# Altium schematic sheet POWER.SchDoc
size 594 x 420 mm; SheetNumber: 4; SheetTotal: 4
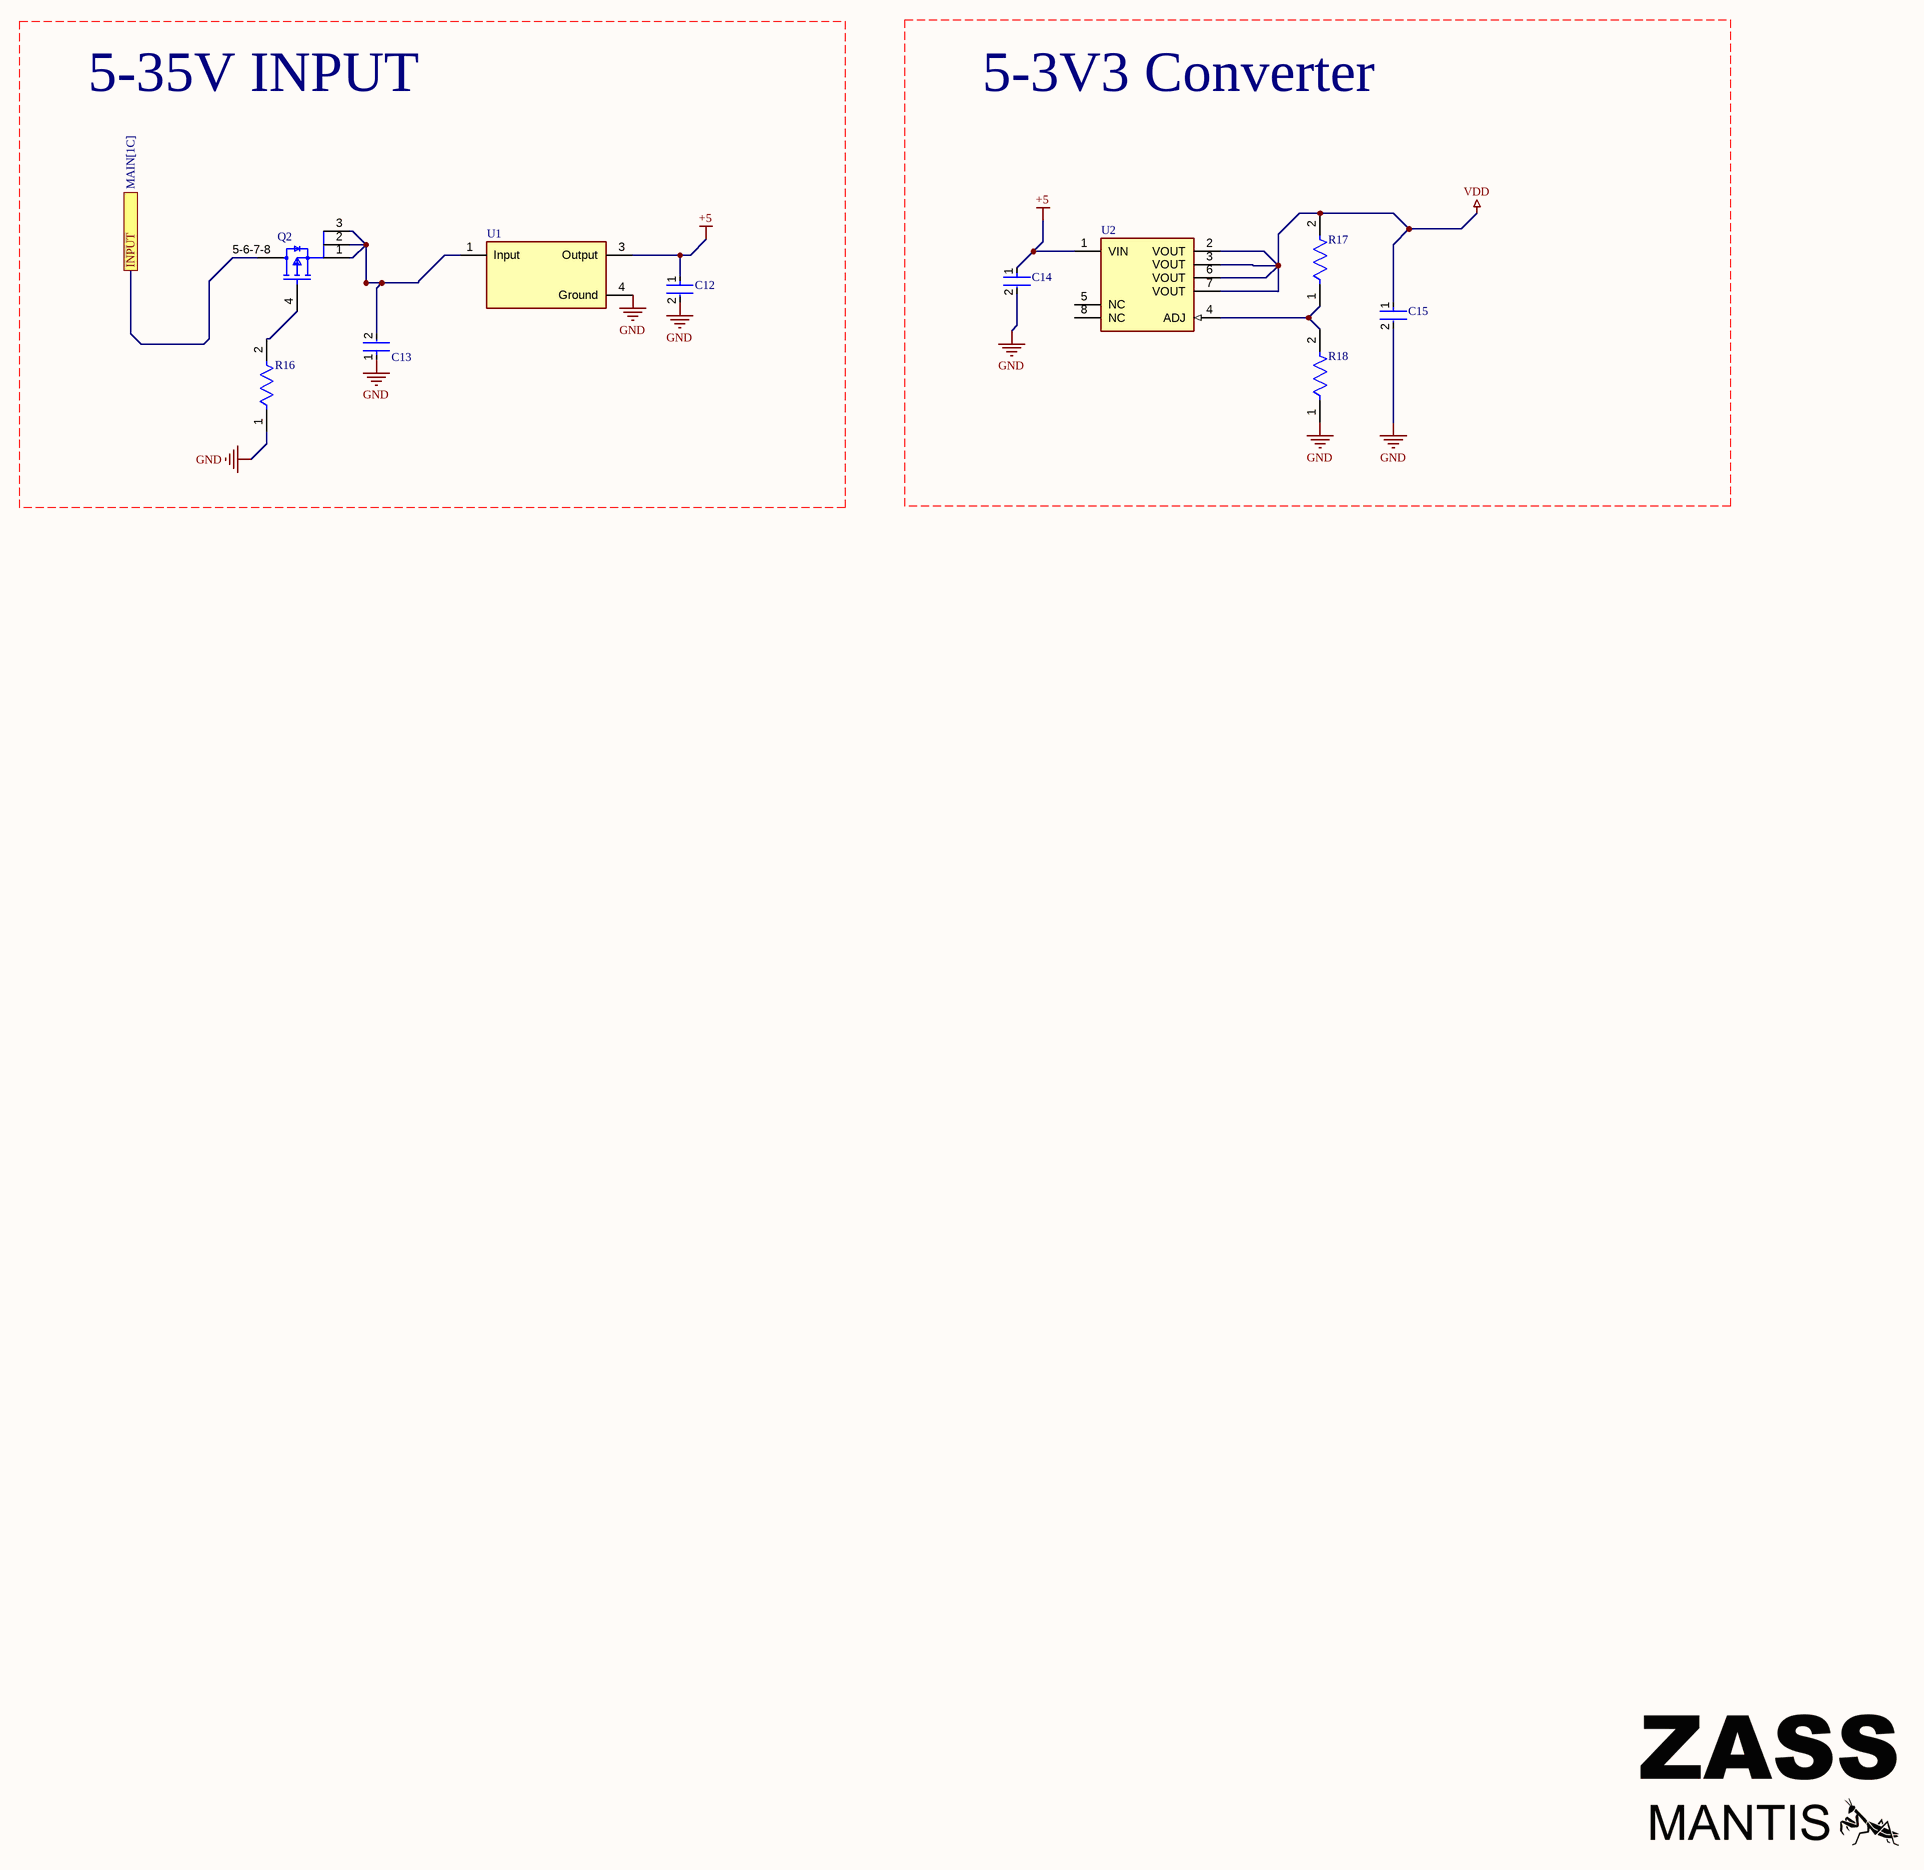
[diagram p0: POWER.SchDoc]

## Parts
C12  CC0805KRX7R5BB104  [FP-CC0805-EA-MFG]  (value not drawn)
C13  C0805C104K5RACTU  [FP-C0805C-DN-MFG]  (value not drawn)
C14  CC0805KRX7R5BB104  [FP-CC0805-EA-MFG]  (value not drawn)
C15  CC0805KRX7R5BB104  [FP-CC0805-EA-MFG]  (value not drawn)
Q2  SI7113ADN-T1-GE3  [FP-S16-2667-SINGLE-MFG]  (value not drawn)
R16  CRGCQ0603F1K2  [FP-CRGCQ0603-IPC_C]  (value not drawn)
R17  CRGCQ0603F1K2  [FP-CRGCQ0603-IPC_C]  (value not drawn)
R18  RC3216J202CS  [FP-RC3216-IPC_A]  (value not drawn)
U1  MC7805CDTRKG  [FP-369C-MFG]  (value not drawn)
U2  LM317LD13TR  [FP-SO-8-0016023-MFG]  (value not drawn)

## Ports
INPUT (see MAIN[1C])

## Nets
+5: C12.1 C14.1 U1.3(Output) U2.1(VIN)
GND: C12.2 C13.1 C14.2 C15.2 R16.1 R18.1 U1.4(Ground)
VDD: C15.1 R17.2 U2.2(VOUT) U2.3(VOUT) U2.6(VOUT) U2.7(VOUT)
INPUT: Q2.5-6-7-8(D) ; port INPUT
NetC13_2: C13.2 Q2.1(S) Q2.2(S) Q2.3(S) U1.1(Input)
NetQ2_4: Q2.4(G) R16.2
NetR17_1: R17.1 R18.2 U2.4(ADJ)

Not connected (* = marked no-connect by the designer): U2 5(NC) 8(NC)

## Notes on the sheet
- 5-35V INPUT
- 5-3V3 Converter
- DWG NO:
- REV:
- THIS DOCUMENT AND THE DATA DISCLOSED HEREIN OR
- HEREWITH IS THE PROPERTY OF ALTIUM LIMITED AND MAY
- BE FREELY DISTRIBUTED IN WHOLE. NO RIGHTS ARE
- RESERVED OR EXPRESS OR IMPLIED WARANTEE GIVEN.
- REVISION
- DESCRIPTION
- DATE
- APPROVED
- PROJECT
- PROJECT REVISION:
- TITLE
- A2
- SIZE
- FILE NAME
- SHEET
- OF

## Library data of the parts
C12 C14 C15 = CMP-03422-000810-2: CAP CER X7R 0805; RoHS Compliant: Yes
C13 = CMP-2007-00279-2: CAP CER 0.1UF 50V X7R 0805; Manufacturer: KEMET; Value: 0.10 μF; Tolerance: 0.1; Temperature Coefficient: 30ppm/°C; Material: Ceramic; Manufacturer Part Number: C0805C104K5RACTU; Device Class L2: Capacitors; Temperature Range Low: -55°C; Voltage Rating: 50 V; Digikey Description: CAP CER 0.1UF 50V X7R 0805; Category: Cap; ComponentLink2Description: Datasheet; Octopart: https://octopart.com/c0805c104k5ractu-kemet-143926; RoHS: TRUE; ComponentLink2URL: https://content.kemet.com/datasheets/KEM_C1003_C0G_SMD.pdf; Temperature Characteristic: X7R; Temperature: -55°C to +125°C; Height: 0.88mm; Temperature Range High: +125°C; Device Class L1: Passive Components; Automotive: No; Lead Free: Yes; Ipc Land Pattern Name: CAPC200125X78; Device Class L3: Ceramic Capacitors; Mouser Description: Cap Ceramic 0.1uF 50V X7R 10% SMD 2.0 x 1.2 mm 125 C Paper T/R; Capacitance: 0.10 μF; Package: C0805C-DN
Q2 = CMP-02550-000064-1: MOSFET P-CH 100V 10.8A 1212-8; Manufacturer: Vishay; Pulse Drain Current: -20A; Reverse Recovery Charge: 80nC; Standoff Height: 0mm; Max Junction Temp: +150°C; Max Forward Diode Voltage: -1.2V; Depletion Mode: False; Turn Off Delay Time: 20ns; Drain To Source Resistance: 0.11Ω; Turn On Delay Time: 10ns; Rthja Max: 36°C/W; Gate Charge At Vgs: 10.9nC @ -10V; Transconductance: 8S; Typ Forward Diode Voltage: -0.8V; Threshold Vgs Max: -2.6V; Drain To Source Voltage: -100V; Power Dissipation: 3.5W; Threshold Vgs Min: -1.1V; Input Capacitace At Vds: 515pF @ -50V; Continuous Drain Current: -3.8A; Number Of P Channels: 1; Reverse Recovery Time: 43ns; Gate To Source Voltage: 20V; Automotive: No; Lead Free: Yes; Temperature Range Low: -55°C; Device Class L1: Discrete Semiconductors; Temperature: -55°C to +150°C; ComponentLink2URL: http://www.vishay.com/docs/77678/si7113adn.pdf; Device Class L3: MOSFETs; Device Class L2: Transistors; Footprint Url: https://www.vishay.com/docs/72597/72597.pdf; Digikey Description: MOSFET P-CH 100V 10.8A 1212-8; RoHS: TRUE; Height: 1.17mm; Package: S16-2667-SINGLE; Octopart: https://octopart.com/si7113adn-t1-ge3-vishay-88182558; ComponentLink2Description: Datasheet; Temperature Range High: +150°C; Manufacturer Part Number: SI7113ADN-T1-GE3; Category: Trans; Drain To Source Breakdown Voltage: -100V; Number Of Channels: 1
R16 R17 = CMP-03211-000516-1: CRGCQ 0603 1K2 1%; Manufacturer: TE Connectivity; Power Rating: 0.1W; Resistance: 1.2KΩ; Value: 1.2KΩ; Voltage Rating: 75V; Temperature Coefficient: ±100ppm/°C; Tolerance: 0.01; Octopart: https://octopart.com/crgcq0603f1k2-te+connectivity-91018051; ComponentLink2Description: Datasheet; ComponentLink2URL: https://www.te.com/commerce/DocumentDelivery/DDEController?Action=showdoc&DocId=Data+Sheet%7F1773204-3%7F1%7Fpdf%7FEnglish%7FENG_DS_1773204-3_1.pdf%7F4-2176339-710; Category: Res; Temperature: -55°C to +155°C; Temperature Range High: +155°C; Ipc Land Pattern Name: RESC16080X45; Device Class L2: Resistors; Height: 0.55mm; Ambient Temperature Range High: +70°C; RoHS: TRUE; Package: CRGCQ0603; Temperature Range Low: -55°C; Digikey Description: CRGCQ 0603 1K2 1%; Series: CRGCQ; Lead Free: Yes; Manufacturer Part Number: CRGCQ0603F1K2; Device Class L1: Passive Components; Composition: Thick Film; Device Class L3: Chip SMD Resistors
R18 = CMP-13261-004107-1: Res Thick Film 1206 2kΩ 5% 0.25W ±100ppm/°C Molded SMD T/R; Voltage Rating (DC): 200V; Resistance: 2kR; Max Power Dissipation: 250mW; Features: Moisture Resistant; Min Operating Temperature: -55°C; Radiation Hardening: No; Lead Free: Lead Free; Height: 0.026inch; Tolerance: 5%; Case/Package: 1206; Case Code (Metric): 3216; Max Operating Temperature: 155°C; Case Code (Imperial): 1206; Length: 0.126inch; Contact Plating: Tin; Temperature Coefficient: 100ppm/°C; Packaging: Tape and Reel; Depth: 1.6mm; Composition: Thick Film; Number of Terminations: 2; Width: 0.063inch
U1 = CMP-07128-000033-1: IC REG LINEAR 5V 1A DPAK; Max Output Voltage: 5.2V; Dropout Voltage: 2V; Accuracy: 4%; Number of Regulators: 1; Min Input Voltage: 10V; Max Input Voltage: 35V; Output Type: Fixed; Power Supply Rejection Ratio (PSRR): 83dB; Polarity: Positive; Quiescent Current: 3.2mA; Mount: Surface Mount; Number of Pins: 3; Nominal Output Voltage: 5V; Lead Free: Lead Free; Contact Plating: Tin; Packaging: Tape and Reel; Max Output Current: 1A; Width: 6.22mm; Min Operating Temperature: 0°C; Min Output Voltage: 5V; Max Operating Temperature: 125°C; Halogen Free: Halogen Free; Output Current: 1A; Output Voltage: 5V; Case/Package: DPAK; Radiation Hardening: No; Number of Outputs: 1; Height: 2.38mm; Package Quantity: 1; REACH SVHC: No SVHC; Output Voltage Accuracy: 4%; Length: 6.73mm
U2 = CMP-0244-00272-2: IC REG LINEAR POS ADJ 100MA 8SO; Output Voltage: 37V; Number of Regulators: 1; Max Output Current: 200mA; Reference Voltage: 1.3V; Max Input Voltage: 40V; Tolerance: 5%; Min Output Voltage: 1.2V; Output Type: Adjustable; Power Supply Rejection Ratio (PSRR): 80dB; Polarity: Positive; Min Input Voltage: 4.2V; Max Output Voltage: 37V; Height: 1.25mm; Min Operating Temperature: 0°C; Radiation Hardening: No; Output Current: 100mA; Number of Outputs: 1; Case/Package: SO; Number of Pins: 8; Package Quantity: 1; REACH SVHC: No SVHC; Lead Free: Lead Free; Packaging: Tape and Reel; Contact Plating: Tin; Max Operating Temperature: 125°C; Length: 5mm; Mount: Surface Mount; Width: 4mm; Weight: 0.01787oz